# EAGLE design thermostat_sensor_esp32 (EAGLE 6.2)
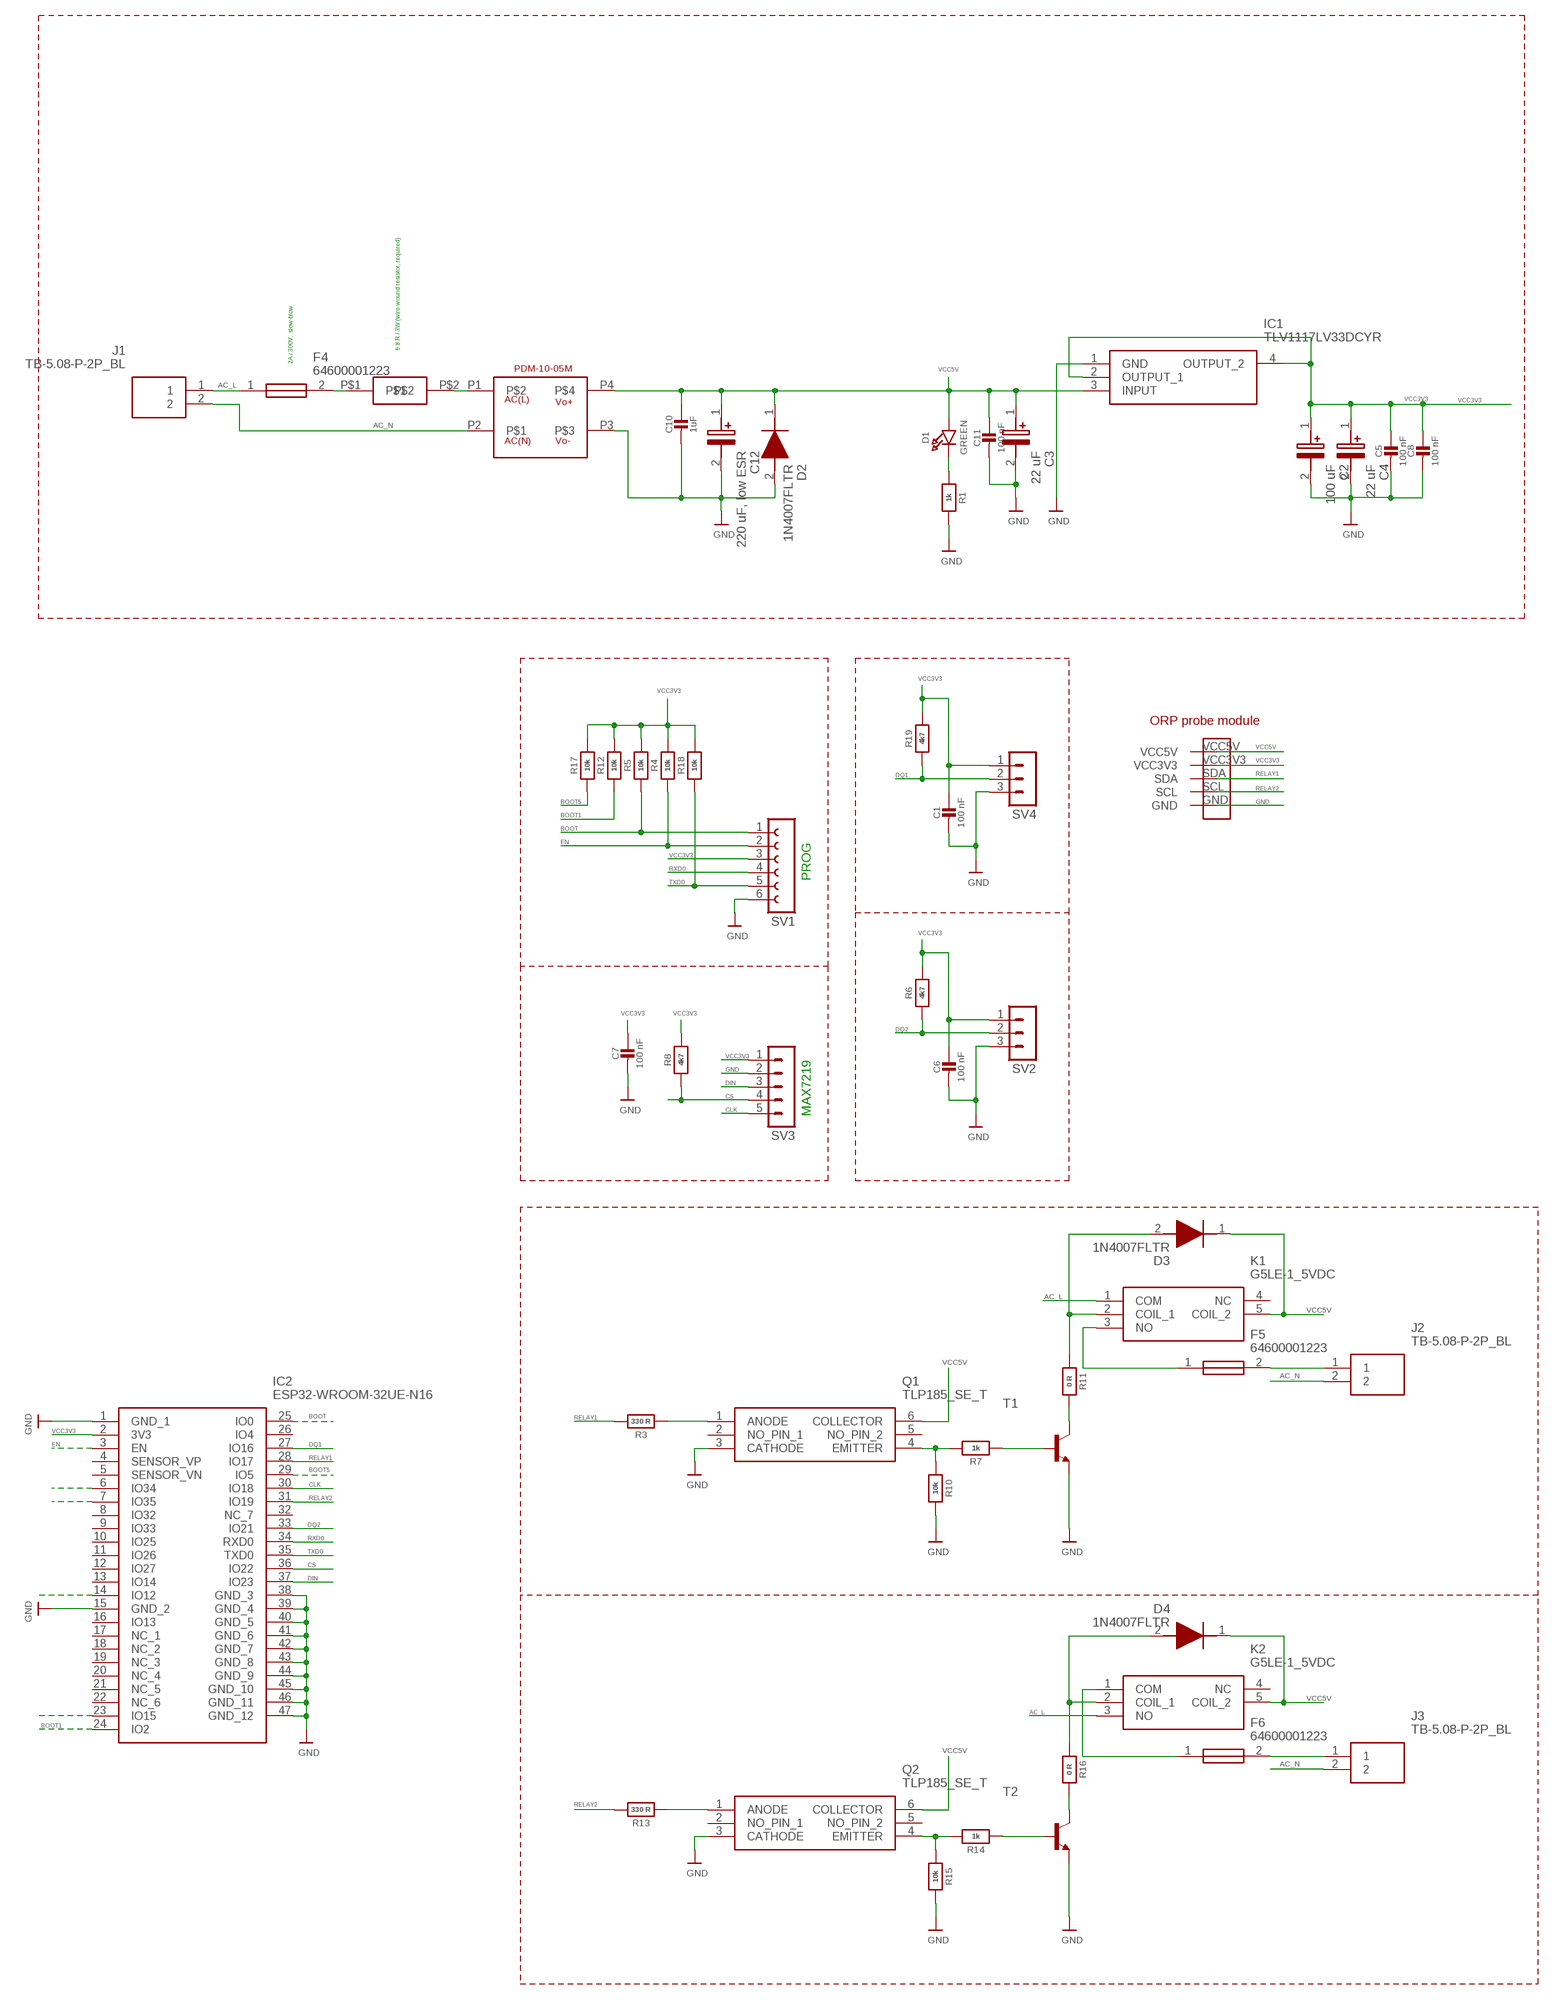
[diagram p0: schematic, sheet 1]

## Parts
C1  100 nF  CAP_CERAMIC_0603  [_0603]
C2  100 uF  293D107X9010C2TE3  [CAPPM6032X280N]
C3  22 uF  293D226X9010A2TE3  [CAPPM3216X180N]
C4  22 uF  293D226X9010A2TE3  [CAPPM3216X180N]
C5  100 nF  CAP_CERAMIC_0603  [_0603]
C6  100 nF  CAP_CERAMIC_0603  [_0603]
C7  100 nF  CAP_CERAMIC_0603  [_0603]
C8  100 nF  CAP_CERAMIC_0603  [_0603]
C10  1uF  CAP_CERAMIC0805-NOOUTLINE  [0805-NO]
C11  100 nF  CAP_CERAMIC_0603  [_0603]
C12  220 uF, low ESR  EEUFR1E221B  [CAPPRD350W65D800H1300]
D1  GREEN  LED0805_NOOUTLINE  [CHIPLED_0805_NOOUTLINE]
D2  1N4007FLTR  [SODFL3718X140N]
D3  1N4007FLTR  [SODFL3718X140N]
D4  1N4007FLTR  [SODFL3718X140N]
F4  64600001223  [64600001223]
F5  64600001223  [64600001223]
F6  64600001223  [64600001223]
IC1  TLV1117LV33DCYR  [SOT230P700X180-4N]
IC2  ESP32-WROOM-32UE-N16  [ESP32WROOM32UEN16]
J1  TB-5.08-P-2P_BL  [TB508P2PBL]
J2  TB-5.08-P-2P_BL  [TB508P2PBL]
J3  TB-5.08-P-2P_BL  [TB508P2PBL]
K1  G5LE-1_5VDC  [G5LE15VDC]
K2  G5LE-1_5VDC  [G5LE15VDC]
Q1  TLP185_SE_T  [SOIC127P700X230-6N]
Q2  TLP185_SE_T  [SOIC127P700X230-6N]
R1  1k  RESISTOR_0603  [_0603]
R3  330 R  RESISTOR_0603  [_0603]
R4  10k  RESISTOR_0603  [_0603]
R5  10k  RESISTOR_0603  [_0603]
R6  4k7  RESISTOR_0603  [_0603]
R7  1k  RESISTOR_0603  [_0603]
R8  4k7  RESISTOR_0603  [_0603]
R10  10k  RESISTOR_0603  [_0603]
R11  0 R  RESISTOR_0603  [_0603]
R12  10k  RESISTOR_0603  [_0603]
R13  330 R  RESISTOR_0603  [_0603]
R14  1k  RESISTOR_0603  [_0603]
R15  10k  RESISTOR_0603  [_0603]
R16  0 R  RESISTOR_0603  [_0603]
R17  10k  RESISTOR_0603  [_0603]
R18  10k  RESISTOR_0603  [_0603]
R19  4k7  RESISTOR_0603  [_0603]
SV1  FE06-1  [FE06]
SV2  MA03-1  [MA03-1]
SV3  MA05-1  [MA05-1]
SV4  MA03-1  [MA03-1]
T1  BC817-16-NPN-SOT23-BEC  [SOT23-BEC]
T2  BC817-16-NPN-SOT23-BEC  [SOT23-BEC]
U$1  PDM-10-05M  [PDM-10-05M]
U$20  6.8 R / 3W (wire-wound resistor, required)  R_HIGH_POWER  [R_HIGH_POWER]
U$21  ORP_PROBE  [ORP_PROBE]

## Nets
AC_L: F4.1 J1.1 K1.1(COM) K2.3(NO)
AC_N: J1.2 J2.2 J3.2 U$1.P2
BOOT: IC2.25(IO0) R5.1 SV1.1
BOOT1: IC2.24(IO2) R12.1
BOOT5: IC2.29(IO5) R17.1
CLK: IC2.30(IO18) SV3.5
CS: IC2.36(IO22) R8.1 SV3.4
DIN: IC2.37(IO23) SV3.3
DQ1: IC2.27(IO16) R19.1 SV4.2
DQ2: IC2.33(IO21) R6.1 SV2.2
EN: IC2.3(EN) R4.1 SV1.2
GND: C1.2 C2.2(-) C3.2(-) C4.2(-) C5.2 C6.2 C7.2 C8.2 C10.2 C11.2 C12.2(-) D2.2(A) IC1.1(GND) IC2.1(GND_1) IC2.15(GND_2) IC2.38(GND_3) IC2.39(GND_4) IC2.40(GND_5) IC2.41(GND_6) IC2.42(GND_7) IC2.43(GND_8) IC2.44(GND_9) IC2.45(GND_10) IC2.46(GND_11) IC2.47(GND_12) Q1.3(CATHODE) Q2.3(CATHODE) R1.2 R10.2 R15.2 SV1.6 SV2.3 SV3.2 SV4.3 T1.E T2.E U$1.P3 U$21.GND
N$1: Q2.1(ANODE) R13.1
N$2: F5.1 K1.3(NO)
N$3: D1.C R1.1
N$4: U$1.P1 U$20.P$2
N$5: F5.2 J2.1
N$6: Q1.1(ANODE) R3.1
N$8: Q1.4(EMITTER) R7.2 R10.1
N$9: R7.1 T1.B
N$10: R11.2 T1.C
N$11: D3.2(A) K1.2(COIL_1) R11.1
N$13: Q2.4(EMITTER) R14.2 R15.1
N$14: R14.1 T2.B
N$15: R16.2 T2.C
N$16: D4.2(A) K2.2(COIL_1) R16.1
N$17: F6.1 K2.1(COM)
N$18: F6.2 J3.1
N$19: F4.2 U$20.P$1
N$20: IC2.23(IO15)
N$21: IC2.14(IO12)
N$22: IC2.6(IO34)
N$23: IC2.7(IO35)
RELAY1: IC2.28(IO17) R3.2 U$21.SDA
RELAY2: IC2.31(IO19) R13.2 U$21.SCL
RXD0: IC2.34(RXD0) SV1.4
TXD0: IC2.35(TXD0) R18.1 SV1.5
VCC3V3: C1.1 C2.1(+) C4.1(+) C5.1 C6.1 C7.1 C8.1 IC1.2(OUTPUT_1) IC1.4(OUTPUT_2) IC2.2(3V3) R4.2 R5.2 R6.2 R8.2 R12.2 R17.2 R18.2 R19.2 SV1.3 SV2.1 SV3.1 SV4.1 U$21.VCC3V3
VCC5V: C3.1(+) C10.1 C11.1 C12.1(+) D1.A D2.1(K) D3.1(K) D4.1(K) IC1.3(INPUT) K1.5(COIL_2) K2.5(COIL_2) Q1.6(COLLECTOR) Q2.6(COLLECTOR) U$1.P4 U$21.VCC5V
Unconnected: IC2.4(SENSOR_VP) IC2.5(SENSOR_VN) IC2.8(IO32) IC2.9(IO33) IC2.10(IO25) IC2.11(IO26) IC2.12(IO27) IC2.13(IO14) IC2.16(IO13) IC2.17(NC_1) IC2.18(NC_2) IC2.19(NC_3) IC2.20(NC_4) IC2.21(NC_5) IC2.22(NC_6) IC2.26(IO4) IC2.32(NC_7) K1.4(NC) K2.4(NC) Q1.2(NO_PIN_1) Q1.5(NO_PIN_2) Q2.2(NO_PIN_1) Q2.5(NO_PIN_2)

## Notes on the sheet
- 6.8 R / 3W (wire-wound resistor, required)
- 2A / 300V,  slow-blow
- ORP probe module
- PROG
- MAX7219

## Library data of the parts
C1 C5-C8 C10 C11 = microbuilder:CAP_CERAMIC: Ceramic Capacitors For new designs, use the packages preceded by an '_' character since they are more reliable: The following footprints should be used on most boards: _0402 - Standard footprint for regular board layouts _0603 - Standard footprint for regular board layouts _0805 - Standard footprint for regular board layouts _1206 - Standard footprint for regular board layouts For extremely tight-pitch boards where space is at a premium, the following 'micro-pitch' footprints can be used (smaller pads, no silkscreen outline, etc.): _0402MP - Micro-pitch footprint for very dense/compact boards _0603MP - Micro-pitch footprint for very dense/compact boards _0805MP - Micro-pitch footprint for very dense/compact boards _1206MP - Micro-pitch footprint for very dense/compact boards
C2 = 293D107X9010C2TE3:293D107X9010C2TE3: Solid Tantalum Surface Mount Chip Capacitors TANTAMOUNT(TM), Molded Case, Standard Industrial Grade Source: Datasheet <http://www.vishay.com/docs/40002/293d.pdf>; DESCRIPTION: Solid Tantalum Surface Mount Chip Capacitors TANTAMOUNT(TM), Molded Case, Standard Industrial Grade; HEIGHT: 2.8mm; MANUFACTURER_NAME: Vishay; MANUFACTURER_PART_NUMBER: 293D107X9010C2TE3
C3 C4 = 293D226X9010A2TE3:293D226X9010A2TE3: Solid Tantalum Surface Mount Chip Capacitors TANTAMOUNT(TM), Molded Case, Standard Industrial Grade Source: Datasheet <http://www.vishay.com/docs/40002/293d.pdf>; DESCRIPTION: Solid Tantalum Surface Mount Chip Capacitors TANTAMOUNT(TM), Molded Case, Standard Industrial Grade; HEIGHT: 1.8mm; MANUFACTURER_NAME: Vishay; MANUFACTURER_PART_NUMBER: 293D226X9010A2TE3
C12 = EEUFR1E221B:EEUFR1E221B: Cap Aluminum Lytic 220uF 25V 20% (8 X 11.5mm) Radial 5mm 950mA 6000h 105C Ammo Pack Source: Datasheet <http://industrial.panasonic.com/cdbs/www-data/pdf/RDF0000/ABA0000C1259.pdf>; DESCRIPTION: Cap Aluminum Lytic 220uF 25V 20% (8 X 11.5mm) Radial 5mm 950mA 6000h 105C Ammo Pack; HEIGHT: 13mm; MANUFACTURER_NAME: Panasonic; MANUFACTURER_PART_NUMBER: EEUFR1E221B
D1 = microbuilder:LED: LED 0603 - 0603 Surface Mount Package 2mA: Green LED - Low Power (3.9mcd, 2ma, 1.7Vf) - Digikey: 475-2709-2-ND Orange LED - Low Power (9.8mcd, 2ma, 1.8Vf) - Digikey: 475-1194-2-ND Red LED - Low Power (5mcd, 2ma, 1.8Vf) - Digikey: 475-1195-2-ND Yellow LED - Low Power (7mcd, 2ma, 1.8Vf) - Digikey: 475-1196-2-ND 5mA: Blue LED - Low Power (17mcd, 5ma, 2.9Vf) - Digikey: LNJ937W8CRACT-ND 0805 - 0805 Surface Mount Package 2mA: Red LED (8.8mcd, 2mA, 1.8Vf, Clear) - Low Power [Digikey: 475-2510-1-ND] Green LED (5mcd, 2mA, 1.8Vf, Clear) - Low Power [Digikey: 475-2730-1-ND] Yellow LED (11.3mcd, 2mA, 1.8Vf, Clear) - Low Power [Digikey: 475-2555-1-ND] 20mA: Red LED (104mcd, 20mA, Diffused) - LS R976 [Digikey: 475-1278-6-ND] Red LED (12mcd, 20mA, 2.0Vf, Clear) - APT2012EC [Digikey: 754-1128-1-ND] Green LED (15mcd, 20mA, 2.2Vf, Clear) - APT2012GC [Digikey: 754-1131-1-ND] Orange LED (160mcd, 20mA, 2.1Vf, Clear) - APT2012SECK [Digikey: 754-1130-1-ND] 1206 - 1206 Surface Mount Package Green LED (26mcd, 20mA, Diffused) - LG N971 [Digikey: 475-1407-6-ND] Red LED (15mcd, 20mA, Diffused) - LH N974 [Digikey: 475-1416-6-ND] Cree - Cree High-Power Surface Mount LEDs XPEBWT-L1-0000-00D50 - White 111lm 350mA 2.9Vf 6200K 110° XTEAWT-00-0000-00000LEE3 - White 114lm 350mA 2.85Vf 5000K 115° Everlight - Everlight 45-21 Series Surface Mount LEDs 45-21/QK2C-B2832AC2CB2/2T - Warm White 2000mcd 20mA 3.25Vf 3050K 120° 45-21/LK2C-B38452C4CB2/2T - Nuetral White 2000mcd 20mA 3.25Vf 4150K 120° 45-21/LK2C-B50634C6CB2/2T - Cold White 2200mcd 20mA 3.25Vf 5650K 120° PLCC2 Reverse Mount LS T77K-J1L2-1-0-2-R18-Z - Red 11.25mcd 2mA 1.8Vf 630nm 120° LO T77K-L1M2-24-Z - Orange 19.6mcd 2mA 1.8Vf 606nm 120° LY T77K-K2M1-26-Z - Yellow 15.7mcd 2mA 1.8Vf 587nm 120°
D2-D4 = 1N4007FLTR:1N4007FLTR: General Purpose Plastic Rectifier Source: Datasheet <http://www.smc-diodes.com/propdf/1N4001FL-1N4007FL N1646 REV.A.pdf>; DESCRIPTION: General Purpose Plastic Rectifier; HEIGHT: 1.4mm; MANUFACTURER_NAME: SMC Diode Solutions; MANUFACTURER_PART_NUMBER: 1N4007FLTR
F4-F6 = 64600001223:64600001223: LITTELFUSE - 64600001223 - FUSE BLOCK, 5X20MM, THROUGH HOLE Source: Datasheet <https://m.littelfuse.com/~/media/electronics/datasheets/fuse_blocks/littelfuse_fuse_block_646_datasheet.pdf.pdf>; DESCRIPTION: LITTELFUSE - 64600001223 - FUSE BLOCK, 5X20MM, THROUGH HOLE; HEIGHT: 12mm; MANUFACTURER_NAME: LITTELFUSE; MANUFACTURER_PART_NUMBER: 64600001223
IC1 = TLV1117LV33DCYR:TLV1117LV33DCYR: 1-A, Positive Fixed Voltage, Low-Dropout Regulator Source: Datasheet <http://www.ti.com/lit/gpn/tlv1117lv>; DESCRIPTION: 1-A, Positive Fixed Voltage, Low-Dropout Regulator; HEIGHT: 1.8mm; MANUFACTURER_NAME: Texas Instruments; MANUFACTURER_PART_NUMBER: TLV1117LV33DCYR
IC2 = ESP32-WROOM-32UE-N16:ESP32-WROOM-32UE-N16: Module: IoT; Bluetooth Low Energy,WiFi; SMD; 18x19.2x3.2mm; U.FL Source: Datasheet <https://www.espressif.com/sites/default/files/documentation/esp32-wroom-32e_esp32-wroom-32ue_datasheet_en.pdf>; DESCRIPTION: Module: IoT; Bluetooth Low Energy,WiFi; SMD; 18x19.2x3.2mm; U.FL; HEIGHT: 3.35mm; MANUFACTURER_NAME: Espressif Systems; MANUFACTURER_PART_NUMBER: ESP32-WROOM-32UE-N16
J1-J3 = TB-5.08-P-2P_BL:TB-5.08-P-2P_BL: PCB terminal block; angled 90; 5.08mm; ways: 2; on PCBs; 1.5mm2 Source: Datasheet <https://www.tme.eu/html/EN/pcb-mount-terminal-blocks-5-00-5-08-mm/ramka_3287_EN_pelny.html>; DESCRIPTION: PCB terminal block; angled 90; 5.08mm; ways: 2; on PCBs; 1.5mm2; HEIGHT: 10mm; MANUFACTURER_NAME: Ninigi; MANUFACTURER_PART_NUMBER: TB-5.08-P-2P/BL
K1 K2 = G5LE-1_5VDC:G5LE-1_5VDC: Relay: electromagnetic; SPDT; Ucoil: 5VDC; Icontacts max: 10A; PCB Source: Datasheet <https://omronfs.omron.com/en_US/ecb/products/pdf/en-g5le.pdf>; DESCRIPTION: Relay: electromagnetic; SPDT; Ucoil: 5VDC; Icontacts max: 10A; PCB; HEIGHT: 19mm; MANUFACTURER_NAME: OMRON Electronics; MANUFACTURER_PART_NUMBER: G5LE-1 5VDC
Q1 Q2 = TLP185_SE_T:TLP185_SE_T: DC Input Phototransistor Output Photocoupler, Surface Mount, 4-Pin SO6 Source: Datasheet <https://toshiba.semicon-storage.com/info/docget.jsp?did=14113&prodName=TLP185(SE>; DESCRIPTION: DC Input Phototransistor Output Photocoupler, Surface Mount, 4-Pin SO6; HEIGHT: 2.3mm; MANUFACTURER_NAME: Toshiba; MANUFACTURER_PART_NUMBER: TLP185(SE(T
R1 R3-R8 R10-R19 = microbuilder:RESISTOR: Resistors For new designs, use the packages preceded by an '_' character since they are more reliable: The following footprints should be used on most boards: _0402 - Standard footprint for regular board layouts _0603 - Standard footprint for regular board layouts _0805 - Standard footprint for regular board layouts _1206 - Standard footprint for regular board layouts For extremely tight-pitch boards where space is at a premium, the following 'micro-pitch' footprints can be used (smaller pads, no silkscreen outline, etc.): _0402MP - Micro-pitch footprint for very dense/compact boards _0603MP - Micro-pitch footprint for very dense/compact boards _0805MP - Micro-pitch footprint for very dense/compact boards _1206MP - Micro-pitch footprint for very dense/compact boards
SV1 = con-lsta:FE06-1: FEMALE HEADER; OC_FARNELL: unknown; OC_NEWARK: unknown
SV2 SV4 = con-lstb:MA03-1: PIN HEADER; OC_FARNELL: unknown; OC_NEWARK: unknown
SV3 = con-lstb:MA05-1: PIN HEADER; OC_FARNELL: unknown; OC_NEWARK: unknown
T1 T2 = transistor:*-NPN-: NPN Transistror BF959 corrected 2008.03.06
U$1 = other:PDM-10-05M
U$20 = other:R_HIGH_POWER
U$21 = other:ORP_PROBE

## Board
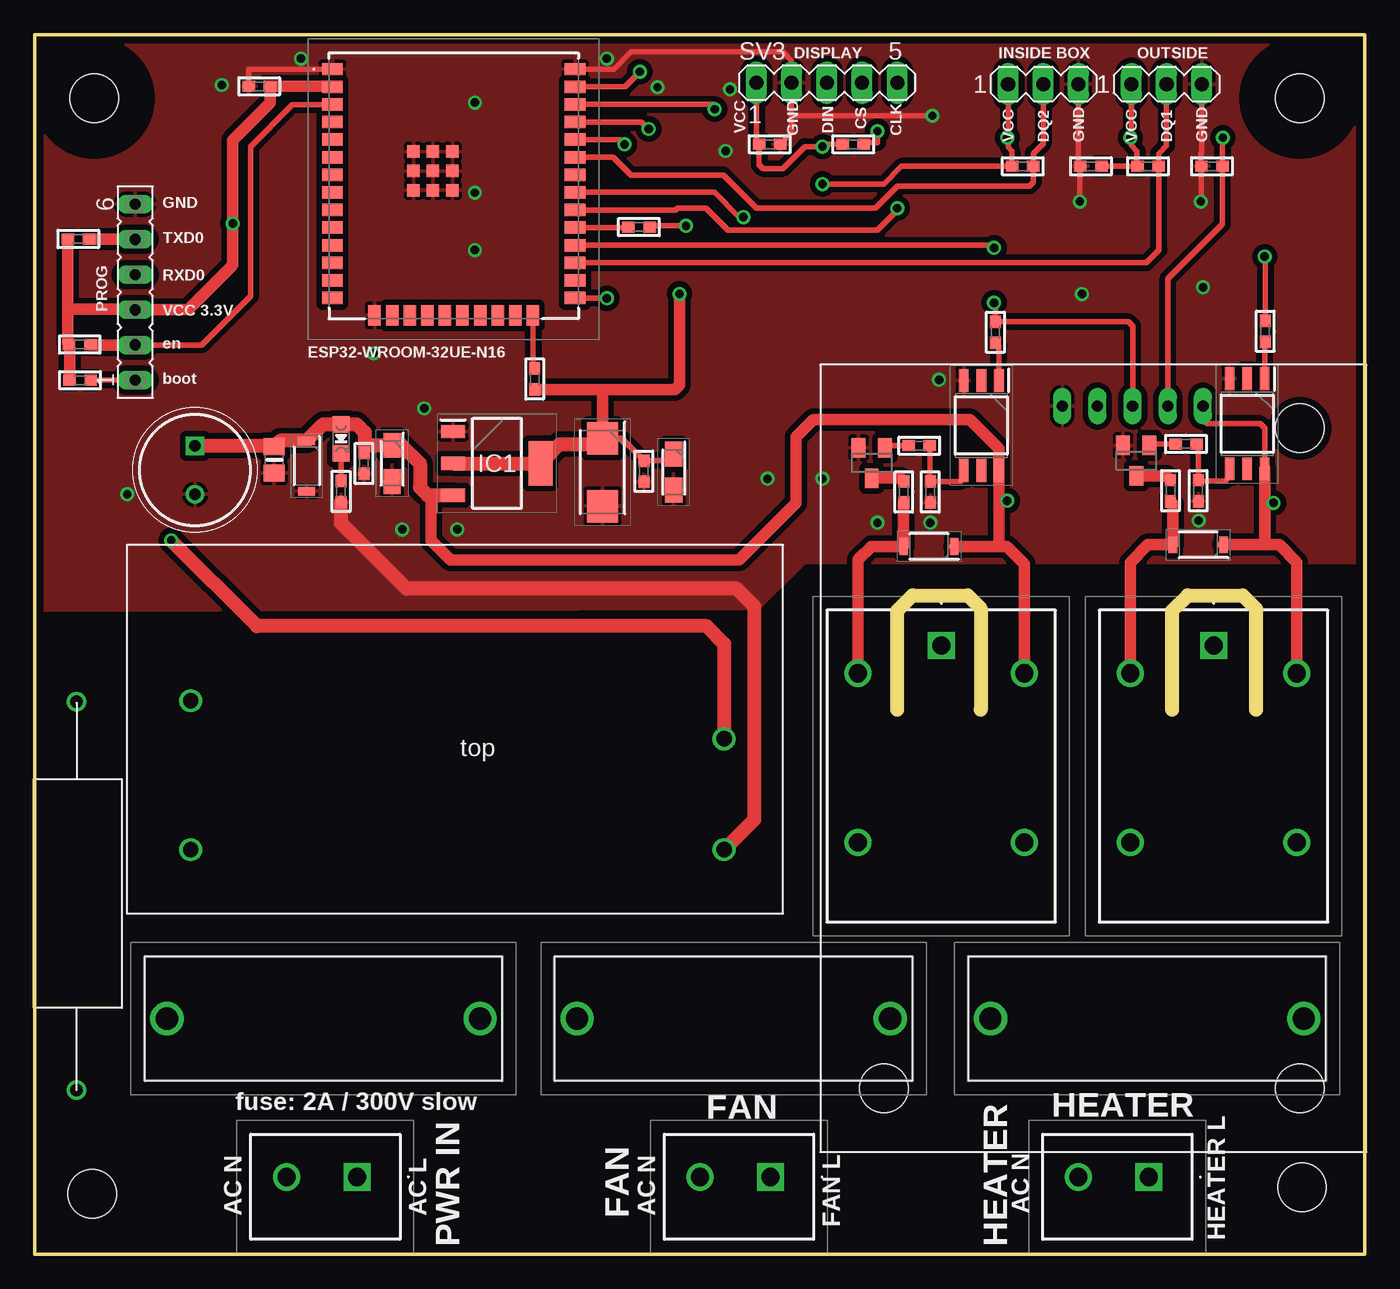
[diagram p1: board, top side]
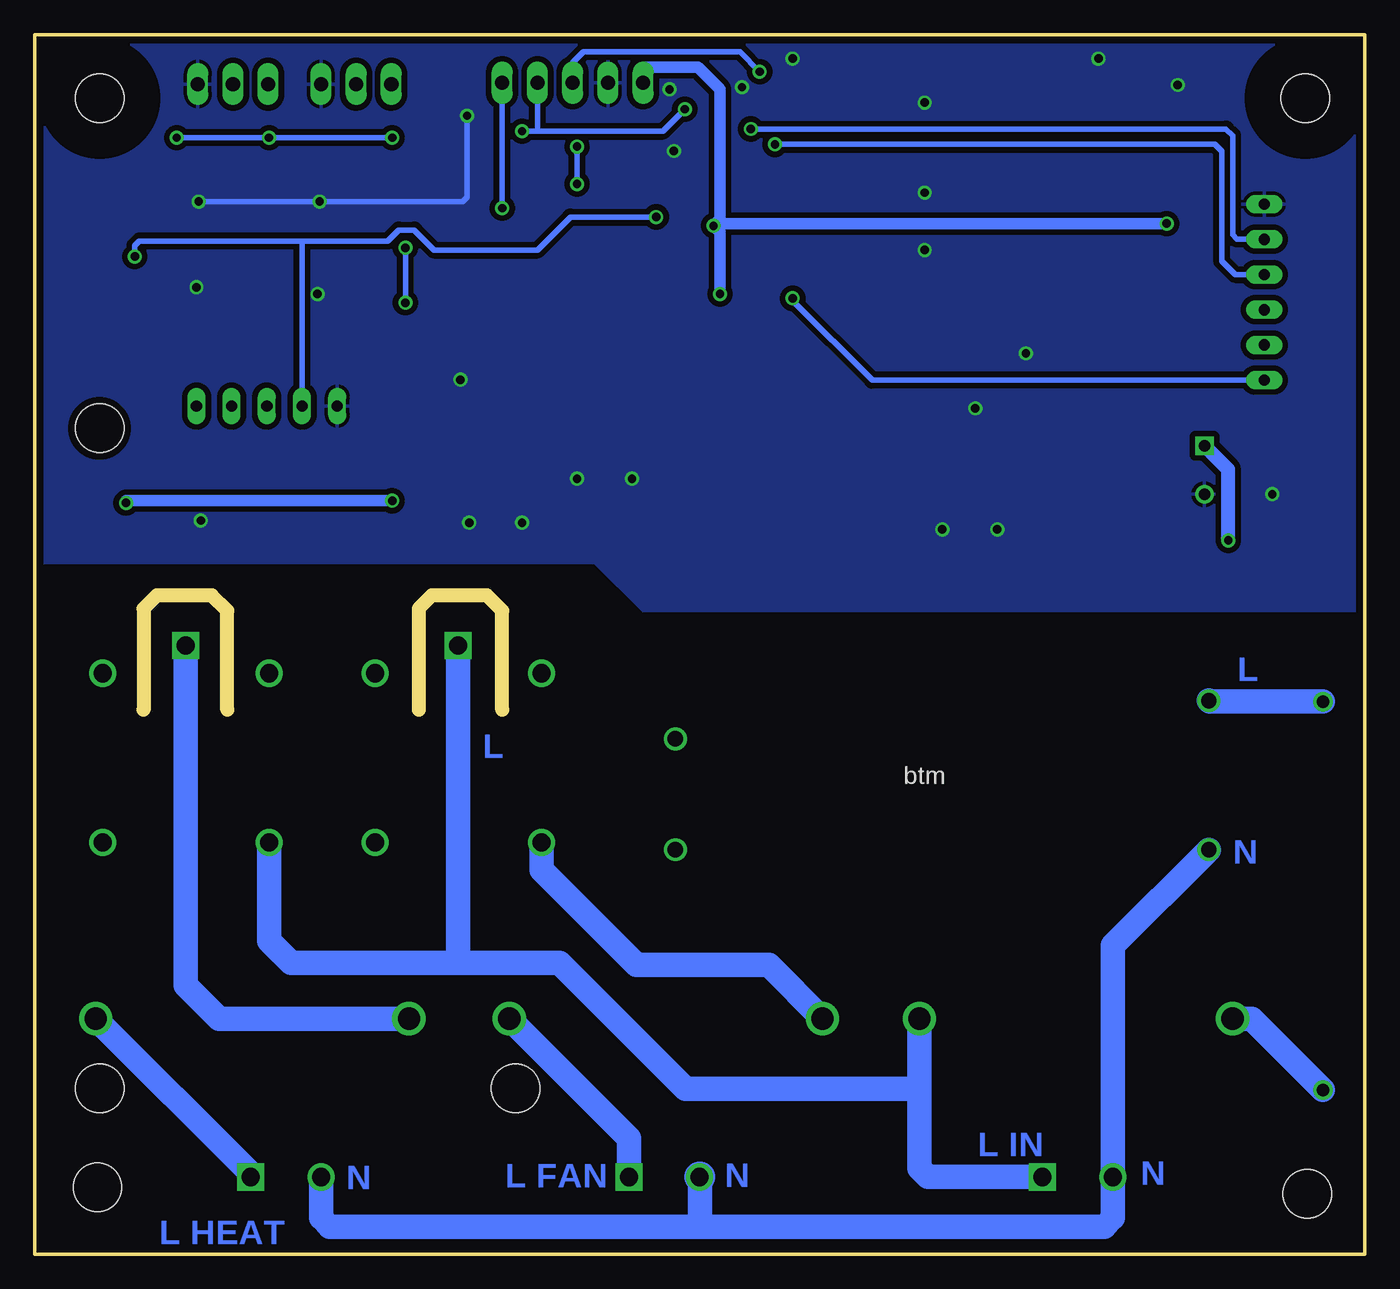
[diagram p2: board, bottom side, seen from below]

Size 95.98 x 88 mm. Coordinates in mm from the lower left corner, seen from the top.
Outline: 0,0 95.98,0 95.98,88 0,88 0,0
Copper layers (1*16): Top 0.035mm / dielectric 1.5mm / Bottom 0.035mm
Design rules: minimum track width 0.3mm, minimum drill 0.5mm, track to track 0.2mm, track to pad 0.2mm, pad to pad 0.2mm, via to via 0.2mm, smd to smd 0.1mm, copper to edge 0.5mm, drill to drill 8mil, minimum pad ring 10mil, minimum via ring 8mil, stop-mask expansion 2mil, vias tented up to drill 20mil, thermal gap 10mil
Holes 3.5 mm at 4.14,4.36 91.45,4.83 4.3,83.42 91.3,83.42
tKeepout: area 1.3,1.5 to 7,7.2; area 88.6,2 to 94.3,7.7; area 1.4,80.5 to 7.2,86.3; area 88.4,80.5 to 94.2,86.3
bKeepout: area 1.3,1.5 to 7,7.2; area 88.6,2 to 94.3,7.6; area 1.5,80.6 to 7.1,86.2; area 88.5,80.6 to 94.1,86.2
tRestrict: area 1.3,1.5 to 7,7.2; area 88.6,2 to 94.3,7.7; area 1.4,80.6 to 7.2,86.3; area 88.4,80.6 to 94.2,86.3
bRestrict: area 1.3,1.5 to 7,7.2; area 88.6,2 to 94.3,7.7; area 1.4,80.6 to 7.2,86.3; area 88.4,80.6 to 94.2,86.3
Milling: 10 lines

### Footprints (pad centres in the part's own frame; a part is rotated, then mirrored left to right if it is on the bottom)
_0603 = smd 0.9 x 0.8: 1 -0.762,0; 2 0.762,0
CAPPM6032X280N = smd 2.35 x 2.25: 1 -2.45,0; 2 2.45,0
CAPPM3216X180N = smd 1.8 x 1.25: 1 -1.3,0; 2 1.3,0
0805-NO = smd 1.24 x 1.5: 1 -0.95,0; 2 0.95,0
CAPPRD350W65D800H1300 = drill 0.85 pad 1.275 square: 1 0,0 | drill 0.85 pad 1.275: 2 3.5,0
CHIPLED_0805_NOOUTLINE = smd 1.2 x 1.2: A 0,-1.05; C 0,1.05
SODFL3718X140N = smd 0.63 x 1.22: 1 -1.825,0; 2 1.825,0
64600001223 = drill 1.6 pad 2.4: 1 0,0; 2 22.6,0
SOT230P700X180-4N = smd 1.75 x 0.95: 1 -3.15,2.3; 2 -3.15,0; 3 -3.15,-2.3 | smd 1.75 x 3.2: 4 3.15,0
ESP32WROOM32UEN16 = smd 1.5 x 0.9: 1 -8.75,8.66; 2 -8.75,7.39; 3 -8.75,6.12; 4 -8.75,4.85; 5 -8.75,3.58; 6 -8.75,2.31; 7 -8.75,1.04; 8 -8.75,-0.23; 9 -8.75,-1.5; 10 -8.75,-2.77; 11 -8.75,-4.04; 12 -8.75,-5.31; 13 -8.75,-6.58; 14 -8.75,-7.85; 25 8.75,-7.85; 26 8.75,-6.58; 27 8.75,-5.31; 28 8.75,-4.04; 29 8.75,-2.77; 30 8.75,-1.5; 31 8.75,-0.23; 32 8.75,1.04; 33 8.75,2.31; 34 8.75,3.58; 35 8.75,4.85; 36 8.75,6.12; 37 8.75,7.39; 38 8.75,8.66 | smd 0.9 x 1.5: 15 -5.715,-9.1; 16 -4.445,-9.1; 17 -3.175,-9.1; 18 -1.905,-9.1; 19 -0.635,-9.1; 20 0.635,-9.1; 21 1.905,-9.1; 22 3.175,-9.1; 23 4.445,-9.1; 24 5.715,-9.1 | smd 0.9 x 0.9: 39 -1.5,1.32; 40 -1.5,-0.08; 41 -0.1,-0.08; 42 -0.1,1.32; 43 -0.1,2.72; 44 -1.5,2.72; 45 -2.9,2.72; 46 -2.9,1.32; 47 -2.9,-0.08
TB508P2PBL = drill 1.3 pad 1.95 square: 1 0,0 | drill 1.3 pad 1.95: 2 5.08,0
G5LE15VDC = drill 1.3 pad 1.95 square: 1 0,0 | drill 1.3 pad 1.95: 2 2,-6; 3 14.2,-6; 4 14.2,6; 5 2,6
SOIC127P700X230-6N = smd 1.65 x 0.7: 1 -3.25,1.27; 2 -3.25,0; 3 -3.25,-1.27; 4 3.25,-1.27; 5 3.25,0; 6 3.25,1.27
FE06 = drill 0.813 long: 1 -6.35,0; 2 -3.81,0; 3 -1.27,0; 4 1.27,0; 5 3.81,0; 6 6.35,0
MA03-1 = drill 1.016 long: 1 -2.54,0; 2 0,0; 3 2.54,0
MA05-1 = drill 1.016 long: 1 -5.08,0; 2 -2.54,0; 3 0,0; 4 2.54,0; 5 5.08,0
SOT23-BEC = smd 1 x 1.4: B -0.95,-1.1; C 0,1.1; E 0.95,-1.1
PDM-10-05M = drill 1.1: P1 0,-10.75; P2 0,0; P3 38.5,0; P4 38.5,-8
R_HIGH_POWER = drill 0.9: P$1 -7.62,0; P$2 20.4,0
ORP_PROBE = drill 0.8 long: GND 17.46,53.82; SCL 20,53.82; SDA 22.54,53.82; VCC3V3 25.08,53.82; VCC5V 27.62,53.82 | hole 3.5: 4.609,4.604; 34.612,4.604; 34.612,52.229

### Placement (x,y rotation side)
C1  84.95,78.49 180 top
C2  40.97,56.43 270 top
C3  25.8,57.06 270 top
C4  46.11,56.43 270 top
C5  43.96,56.49 270 top
C6  76.21,78.49 180 top
C7  53.04,80.08 0 top
C8  16.21,84.27 180 top
C10  17.29,57.32 270 top
C11  23.76,57.06 270 top
C12  11.57,58.33 270 top
D1  22.11,58.84 180 top
D2  19.64,56.87 270 top
D3  64.53,51.06 180 top
D4  83.96,51.19 180 top
F4  32.14,17 180 top
F5  39.13,17 0 top
F6  68.97,17 0 top
IC1  33.35,57.06 0 top
IC2  30.24,76.84 0 top
J1  23.26,5.57 180 top
J2  53.1,5.57 180 top
J3  80.41,5.57 180 top
K1  65.42,43.92 270 top
K2  85.07,43.92 270 top
Q1  68.31,59.79 270 top
Q2  87.49,59.92 270 top
R1  22.11,55.03 270 top
R3  69.32,66.52 90 top
R4  3.25,65.64 180 top
R5  3.28,63.06 180 top
R6  71.29,78.49 180 top
R7  63.83,58.33 0 top
R8  59.07,80.08 180 top
R10  64.63,55 270 top
R11  62.72,55 90 top
R12  36.08,63.16 270 top
R13  88.79,66.59 90 top
R14  83.07,58.46 0 top
R15  83.96,55.09 270 top
R16  81.96,55.09 90 top
R17  43.61,74.11 0 top
R18  3.16,73.26 180 top
R19  80.34,78.49 180 top
SV1  7.25,69.41 90 top
SV2  72.78,84.43 0 top
SV3  57.16,84.53 0 top
SV4  81.67,84.43 0 top
T1  60.4,57.1 180 top
T2  79.48,57.25 180 top
U$1  11.25,29.19 180 bottom
U$20  3.03,19.47 90 top
U$21  56.69,7.37 0 top

### Tracks (layer width: path | path; a pad name or v marks a point on that pad's centre or on a via)
AC_L
  Bottom 1.016: F4.1 32.18,17
  Bottom 1.778: J1.1 31.51,5.57 32.15,6.2 32.15,11.95 | 32.15,11.95 F4.1 | 32.15,11.95 49.04,11.95 58.12,21.03 65.42,21.03 | 65.42,21.03 K1.1 | 65.42,21.03 77.48,21.03 79.07,22.62 K2.3
AC_N
  Bottom 1.778: 47.96,1.98 18.81,1.98 18.18,2.61 18.18,3.85 J1.2 18.18,22.27 U$1.P2 | 47.96,1.98 47.96,5.57 | 47.96,1.98 74.69,1.98 75.33,2.61 J3.2
  Bottom 2.184: 47.96,5.57 J2.2
BOOT  (via drill 0.6)
  Top 0.406: SV1.1 R5.1 | v41.29,68.97 39.01,68.97 IC2.25
  Bottom 0.406: SV1.1 35.54,63.06 41.29,68.81 v41.29,68.97
BOOT1
  Top 0.406: IC2.24 35.96,64.05 R12.1
BOOT5
  Top 0.406: IC2.29 42.81,74.07 R17.1
CLK  (via drill 0.6)
  Top 0.406: IC2.30 46.23,75.34 46.37,75.48 48.43,75.48 50.02,73.89 60.82,73.89 62.24,75.32 v62.24,75.48
  Bottom 0.406: v62.24,75.48 SV3.5
CS  (via drill 0.6)
  Top 0.406: IC2.36 49.04,82.96 49.04,82.65 v49.07,82.62 | R8.1 59.7,80.21 60.82,80.21 v60.82,81.04
  Bottom 0.406: 59.7,81.04 SV3.4 | 59.7,81.04 50.66,81.04 v49.07,82.62 | v60.82,81.04 59.7,81.04
DIN  (via drill 0.6)
  Top 0.406: IC2.37 42.58,84.23 v43.67,85.32
  Bottom 0.406: v43.67,85.32 45.1,86.75 56.37,86.75 57.16,85.96 SV3.3
DQ1
  Top 0.406: SV4.2 81.68,79.99 81.1,79.42 R19.1 81.14,78.46 81.14,72.46 80.21,71.53 IC2.27
DQ2
  Top 0.406: SV2.2 72.79,80.15 72.06,79.42 R6.1 | 72.09,78.46 R6.1 | R6.1 72.06,77.35 71.77,77.07 62.24,77.07 60.66,75.48 52.08,75.48 49.7,77.86 43.04,77.86 41.74,79.15 IC2.33
EN
  Top 0.406: SV1.2 12.05,65.6 15.57,69.13 15.57,79.92 18.59,82.94 21.47,82.94 IC2.3
  Top 0.813: R4.1 4.05,65.6 SV1.2
GND  (via drill 0.6)
  Top 0.406: IC2.1 15.44,85.5 C8.2 | IC2.38 41.79,85.5 43.04,86.75 53.99,86.75 54.62,86.12 SV3.2 54.62,82.15 | C7.2 54.62,80.91 54.62,82.15 | SV2.3 75.33,78.62 C6.2 75.42,78.46 v75.42,75.95 | SV4.3 84.22,79.51 84.15,79.45 84.15,78.53 C1.2 84.18,75.99 v84.15,75.95 | 26.37,56.11 26.14,56.11 C3.2 | v64.78,82.15 54.62,82.15
  Top 1.016: R1.2 22.11,52.75 26.84,48.02 50.66,48.02 51.93,46.74 51.93,31.36 U$1.P3
  Bottom 0.406: v84.15,75.95 v75.42,75.95 65.1,75.95 64.78,76.27 v64.78,82.15
  other vias: 64.63,52.78 60.82,52.78 83.99,52.94 56.85,55.95 52.88,55.95 30.49,52.3 26.53,52.3 28.11,61.03 24.46,65 31.76,72.46 31.76,76.59 31.76,83.1 19.22,86.27 41.29,86.27 13.51,84.37 6.68,54.84 84.31,69.76 75.58,69.29 65.26,63.1 49.86,79.61 50.18,84.05 44.94,84.21
  pour Top (isolate 0.406): 0.33,87.54 95.74,87.7 95.58,49.92 55.58,49.92 52.24,46.59 0.33,46.43
  pour Bottom (isolate 0.406): 0.33,87.54 95.74,87.7 95.58,49.92 55.58,49.92 52.08,46.43 0.33,46.43
N$1
  Top 0.406: Q2.1 88.76,65.79 R13.1
N$2
  Bottom 1.778: F5.1 43,20.87 52.56,20.87 59.42,27.73 K1.3
N$3
  Top 0.406: D1.C R1.1
N$4
  Bottom 1.778: U$20.P$2 11.19,39.87 U$1.P1
N$5
  Bottom 1.778: F5.2 53.1,8.37 J2.1
N$6
  Top 0.406: Q1.1 69.58,65.51 R3.1
N$8
  Top 0.406: R7.2 64.59,55.79 R10.1 66.82,55.76 67.04,55.98 Q1.4
N$9
  Top 0.406: R7.1 61.49,58.33 T1.B
N$10
  Top 0.813: R11.2 62.49,56 T1.C
N$11
  Top 0.406: R11.1 62.71,54.22
  Top 0.813: 62.71,54.22 D3.2 60.37,51.06 59.42,50.11 K1.2
N$13
  Top 0.406: Q2.4 86.22,56.11 85.9,55.79 84.02,55.79 R15.1 83.96,58.33 R14.2
N$14
  Top 0.406: R14.1 80.54,58.46 T2.B
N$15
  Top 0.813: T2.C 81.66,56.15 R16.2
N$16
  Top 0.406: R16.1 82.14,54.16 | 79.07,49.92 79.07,49.6
  Top 0.813: 82.14,54.16 D4.2 80.34,51.19 79.07,49.92 | 79.07,49.6 K2.2
N$17
  Bottom 1.778: F6.1 82.66,17 85.07,19.41 K2.1
N$18
  Bottom 1.016: 80.41,5.83 J3.1
  Bottom 1.778: F6.2 80.41,5.83
N$19
  Bottom 1.778: F4.2 8.17,17 U$20.P$1
RELAY1  (via drill 0.6)
  Top 0.406: IC2.28 69.05,72.8 v69.23,72.62 | v69.23,68.65 69.32,68.56 R3.2 78.91,67.29 79.23,66.97 U$21.SDA
  Bottom 0.406: v69.23,68.65 v69.23,72.62
RELAY2  (via drill 0.6)
  Top 0.406: IC2.31 49.04,76.61 50.81,74.84 v51.13,74.84 | v88.76,71.99 88.79,71.95 R13.2
  Bottom 0.406: 76.69,73.1 70.5,73.1 69.71,73.89 68.59,73.89 67.17,72.46 59.7,72.46 57.32,74.84 v51.13,74.84 | v88.76,71.99 88.76,72.78 88.44,73.1 76.69,73.1 | U$21.SCL 76.69,73.1
RXD0  (via drill 0.6)
  Top 0.406: IC2.34 42.22,80.42 v42.56,80.08
  Bottom 0.406: v42.56,80.08 10.81,80.08 10.33,79.61 10.33,71.67 9.35,70.68 SV1.4
TXD0  (via drill 0.6)
  Top 0.406: IC2.35 43.81,81.69 v44.31,81.19
  Top 0.813: SV1.5 7.22,73.26 R18.1
  Bottom 0.406: v44.31,81.19 10.02,81.19 9.54,80.72 9.54,73.57 9.22,73.26 7.28,73.26 SV1.5
VCC3V3  (via drill 0.6)
  Top 0.406: 21.45,84.27 IC2.2 | 17,84.24 C8.1 | 2.49,63.1 R5.2 | SV3.1 52.08,80.27 C7.1 52.27,78.62 52.56,78.34 53.99,78.34 55.58,79.92 v56.85,79.92 56.85,80.08 R8.2 | SV2.1 70.25,80.57 | 70.25,80.57 70.25,79.86 70.5,79.61 70.5,78.53 R6.2 62.56,78.49 61.29,77.23 v56.85,77.23 | SV4.1 79.14,80.56 | 79.14,80.56 79.14,80.02 79.55,79.61 79.55,78.53 R19.2 C6.1 | R17.2 44.46,74.21 v47,74.21 | 40.36,58.27 40.54,58.45 C2.1 42.33,58.88 C5.1 45.64,57.25 C4.1 | 6.36,68.18 6.4,68.14 | 70.25,80.57 v70.18,80.57 v70.18,80.56 | v79.07,80.56 79.14,80.56 | v85.74,80.56 85.74,80.46 85.71,80.43 C1.1 85.71,74.34 81.77,70.4 U$21.VCC3V3
  Top 0.813: C8.1 21.45,84.27 | 17,84.24 17,83.1 14.3,80.4 v14.3,74.37 14.3,71.35 11.09,68.14 SV1.3 6.4,68.14 | R18.2 2.4,68.18 | C2.1 40.97,62.4 | 2.4,68.18 6.36,68.18 | 2.4,68.18 2.4,65.73 R4.2 2.52,65.6 R5.2 | R12.2 40.97,62.4 | 40.97,62.4 46.21,62.4 46.53,62.72 v46.53,69.29
  Top 1.016: IC1.2 IC1.4 37.89,58.45 40.54,58.45
  Bottom 0.406: v56.85,77.23 v56.85,79.92 | 51.93,85.64 52.08,85.48 | 14.46,74.37 v14.3,74.37 | v70.18,80.56 v79.07,80.56 v85.74,80.56
  Bottom 0.813: 46.85,74.37 46.53,74.68 46.53,84.05 48.12,85.64 51.93,85.64 | 52.08,85.48 SV3.1 | 46.85,74.37 14.46,74.37 | v46.53,69.29 46.53,73.73 v47,74.21 46.85,74.37
VCC5V  (via drill 0.6)
  Top 0.406: 69.58,54.29 70.1,54.29 v70.18,54.36 | 88.8,54.21 88.76,54.16 | 17.22,58.33 C10.1 | C11.1 23.83,57.89 23.83,58.33 23.86,58.36 | Q2.6 88.76,59.6 88.44,59.92 84.63,59.92 84.31,60.24 U$21.VCC5V
  Top 0.813: Q2.6 88.76,54.16 88.76,51.19 | v89.39,54.21 88.8,54.21 | D4.1 88.76,51.19 | 88.76,51.19 89.8,51.19 91.07,49.92 K2.5 | D3.1 69.55,51.06 | 69.55,51.06 70.15,51.06 71.42,49.79 K1.5 | 69.55,51.06 69.58,51.09 69.58,54.29 Q1.6 69.58,58.14 67.48,60.24 56.21,60.24 54.94,58.97 54.94,54.21 50.81,50.08 30.02,50.08 28.59,51.51 28.59,54.76
  Top 1.016: C12.1 17.22,58.33 | C10.1 17.72,58.7 D2.1 20.83,59.89 D1.A 23.22,59.89 23.83,59.29 23.83,58.33 | 23.86,58.36 C3.1 26.5,58.36 27.8,57.06 27.8,55.32 28.35,54.76 28.59,54.76 IC1.3 | U$1.P4 49.75,44.05 48.48,45.32 16.05,45.32 v9.86,51.51
  Bottom 0.406: 89.39,54.36 v89.39,54.21
  Bottom 0.813: v70.18,54.36 89.39,54.36
  Bottom 1.016: v9.86,51.51 9.86,56.62 C12.1

### Text on the board
Bottom: L | L | N | L IN | L FAN | N | N | N | L HEAT
tPlace: DISPLAY | INSIDE BOX | OUTSIDE | VCC | GND | DIN | CS | CLK | VCC | DQ2 | GND | VCC | DQ1 | GND | GND | TXD0 | RXD0 | PROG | VCC 3.3V | en | ESP32-WROOM-32UE-N16 | boot | fuse: 2A / 300V slow | FAN | HEATER | AC N | AC L | FAN | AC N | AC N | FAN L | HEATER L | PWR IN | HEATER